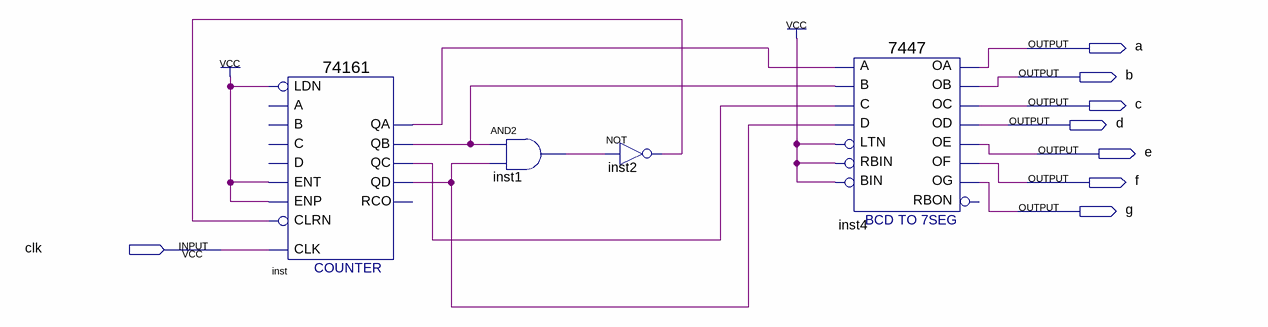
[diagram p0: schematic sheet]
// Quartus schematic tb.bdf as structural Verilog: 4 symbols, 8 pins
module tb (
  input  clk,
  output a,
  output b,
  output c,
  output d,
  output e,
  output f,
  output g
);

  wire inst1_out, inst2_out, inst_qa, inst_qb, inst_qc, inst_qd;

  \74161  inst (
    .CLRN(inst2_out), .CLK(clk), .ENP(1'b1), .LDN(1'b1), .ENT(1'b1), .QD(inst_qd), .QC(inst_qc),
    .QB(inst_qb), .QA(inst_qa));  // open: A, D, B, C, RCO
  and inst1 (inst1_out, inst_qb, inst_qd);
  not inst2 (inst2_out, inst1_out);
  \7447  inst4 (
    .LTN(1'b1), .B(inst_qb), .C(inst_qc), .D(inst_qd), .RBIN(1'b1), .BIN(1'b1), .A(inst_qa), .OB(b), .OC(c),
    .OE(e), .OD(d), .OF(f), .OG(g), .OA(a));  // open: RBON
endmodule
